# EAGLE design usb2ax_mini (EAGLE 5.11)
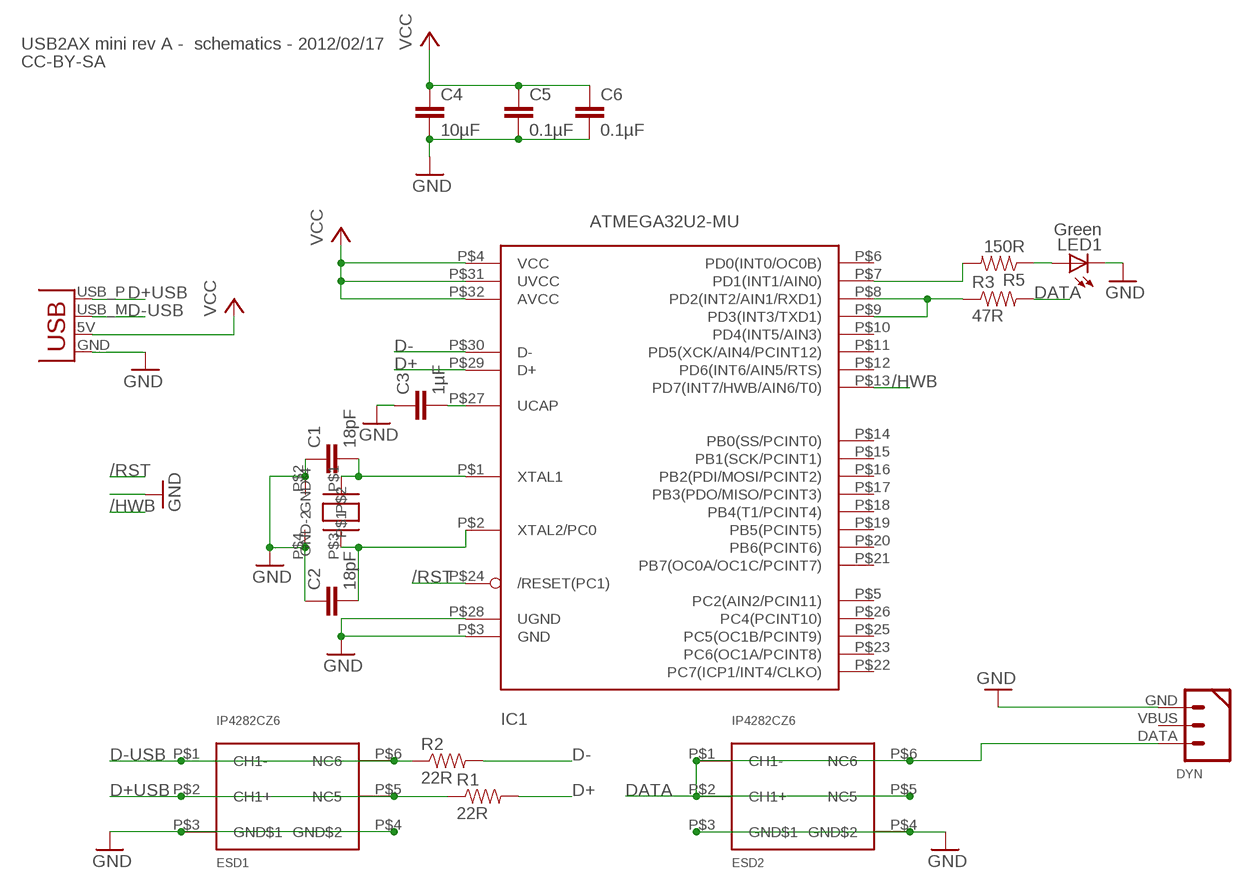
[diagram p0: schematic, sheet 1]

## Parts
C1  18pF  CAP0402-JLG  [0402-JLG]
C2  18pF  CAP0402-JLG  [0402-JLG]
C3  1µF  CAP0402-JLG  [0402-JLG]
C4  10µF  CAP0805  [0805]
C5  0.1µF  CAP0402-JLG  [0402-JLG]
C6  0.1µF  CAP0402-JLG  [0402-JLG]
DYN  DYNAMIXEL_3POS  [DYMANIXEL_3POS_RIGHT]
ESD1  IP4282CZ6  [SOT886]
ESD2  IP4282CZ6  [SOT886]
IC1  ATMEGA32U2-MU  ATMEGA32U2-AU  [QFN-32]
LED1  Green  LED-0603  [0603-LED]
Q  CRYSTAL  [MODEL-403]
R1  22R  RESISTOR0402-JLG  [0402-JLG]
R2  22R  RESISTOR0402-JLG  [0402-JLG]
R3  47R  RESISTOR0402-JLG  [0402-JLG]
R5  150R  RESISTOR0402-JLG  [0402-JLG]
X1  USBPCB  [USB-A-PCB]

## Nets
/HWB: IC1.P$13(PD7(INT7/HWB/AIN6/T0))
/RST: IC1.P$24(/RESET(PC1))
D+: IC1.P$29(D+) R1.P$2
D+USB: ESD1.P$2(CH1+) ESD1.P$5(NC5) R1.P$1 X1.USB_P(D+)
D-: IC1.P$30(D-) R2.P$2
D-USB: ESD1.P$1(CH1-) ESD1.P$6(NC6) R2.P$1 X1.USB_M(D-)
DATA: DYN.DATA ESD2.P$1(CH1-) ESD2.P$2(CH1+) ESD2.P$5(NC5) ESD2.P$6(NC6) R3.P$2
GND: C1.P$1 C2.P$1 C3.P$1 C4.2 C5.P$2 C6.P$2 DYN.GND ESD1.P$3(GND$1) ESD1.P$4(GND$2) ESD2.P$3(GND$1) ESD2.P$4(GND$2) IC1.P$3(GND) IC1.P$28(UGND) LED1.C Q.P$2(GND-2) Q.P$4(GND-4) X1.GND
N$1: IC1.P$7(PD1(INT1/AIN0)) R5.P$2
N$3: C1.P$2 IC1.P$1(XTAL1) Q.P$1
N$4: C2.P$2 IC1.P$2(XTAL2/PC0) Q.P$3
N$10: C3.P$2 IC1.P$27(UCAP)
N$13: IC1.P$8(PD2(INT2/AIN1/RXD1)) IC1.P$9(PD3(INT3/TXD1)) R3.P$1
N$14: LED1.A R5.P$1
VCC: C4.1 C5.P$1 C6.P$1 IC1.P$4(VCC) IC1.P$31(UVCC) IC1.P$32(AVCC) X1.5V(VBUS)
Unconnected: DYN.VBUS IC1.P$5(PC2(AIN2/PCIN11)) IC1.P$6(PD0(INT0/OC0B)) IC1.P$10(PD4(INT5/AIN3)) IC1.P$11(PD5(XCK/AIN4/PCINT12)) IC1.P$12(PD6(INT6/AIN5/RTS)) IC1.P$14(PB0(SS/PCINT0)) IC1.P$15(PB1(SCK/PCINT1)) IC1.P$16(PB2(PDI/MOSI/PCINT2)) IC1.P$17(PB3(PDO/MISO/PCINT3)) IC1.P$18(PB4(T1/PCINT4)) IC1.P$19(PB5(PCINT5)) IC1.P$20(PB6(PCINT6)) IC1.P$21(PB7(OC0A/OC1C/PCINT7)) IC1.P$22(PC7(ICP1/INT4/CLKO)) IC1.P$23(PC6(OC1A/PCINT8)) IC1.P$25(PC5(OC1B/PCINT9)) IC1.P$26(PC4(PCINT10))

## Notes on the sheet
- USB2AX mini rev A -  schematics - 2012/02/17
- CC-BY-SA

## Library data of the parts
C1-C6 = ParanoidStudio:CAP: Capacitor Standard 0603 ceramic capacitor, and 0.1" leaded capacitor.
DYN = ParanoidStudio:DYNAMIXEL_3POS
ESD1 ESD2 = ParanoidStudio:IP4282CZ6: Ultra-low capacitance ESD protection for high-speed interfaces
IC1 = ParanoidStudio:ATMEGA32U2: ATmega32u2 Pin compatible with the atmega8u2, atmega16u2 and atmega32u2 8, 16 or 32 K flash, 1K RAM, 512b EEPROM 8 bit and 16 bit timer (5 PWM total) UART, SPI (no I2C!) USB with 4 endpoints, LUFA compatible 22 I/O lines, analog comparator (no ADC!) Comes with DFU bootloader burned in!
LED1 = ParanoidStudio:LED
Q = ParanoidStudio:CRYSTAL
R1-R3 R5 = ParanoidStudio:RESISTOR: Resistor Basic schematic elements and footprints for 0603, 1206, and PTH 1/10th watt (small) resistors.
X1 = SparkFun-paranoidstudio:USB: USB Connectors USB-B-PTH is fully proven SKU : PRT-00139 USB-miniB is fully proven SKU : PRT-00587 USB-A-PCB is untested. USB-A-H is throughly reviewed, but untested. Spark Fun Electronics SKU : PRT-00437 USB-B-SMT is throughly reviewed, but untested. Needs silkscreen touching up. USB-A-S has not been used/tested USB-MB-H has not been used/tested

## Board
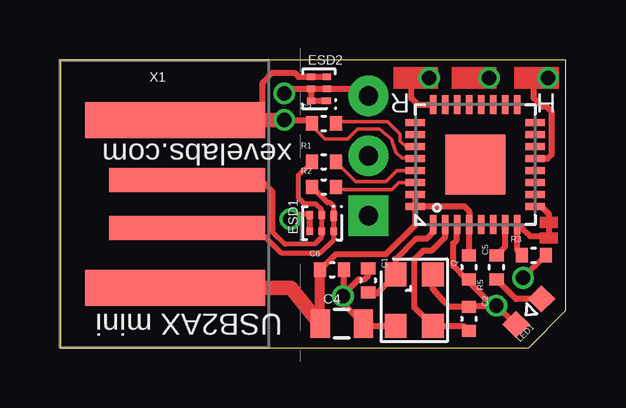
[diagram p1: board, top side]
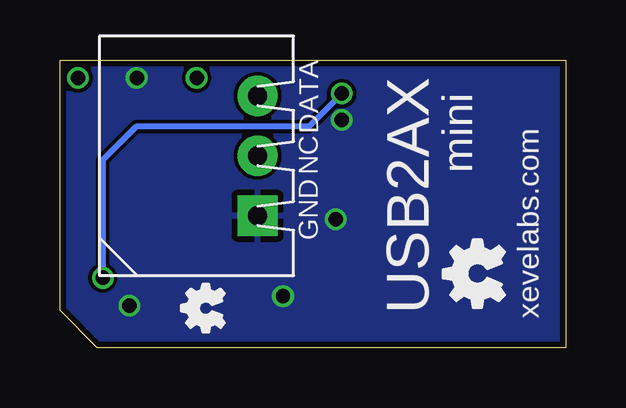
[diagram p2: board, bottom side, seen from below]

Size 21.1 x 12 mm. Coordinates in mm from the lower left corner, seen from the top.
Outline: 21.1,1.55 21.1,12 0,12 0,0 19.55,0 21.1,1.55
Copper layers (1*16): Top 0.035mm / dielectric 1.5mm / Bottom 0.035mm
Design rules "Fusion_eagle_rule_v1.1": minimum track width 6mil, minimum drill 12mil, track to track 6mil, track to pad 6mil, pad to pad 6mil, via to via 6mil, smd to smd 0mil, copper to edge 10mil, drill to drill 10mil, minimum pad ring 10mil, minimum via ring 6mil, stop-mask expansion 2mil, vias tented up to drill 100mil, thermal gap 10mil

### Footprints (pad centres in the part's own frame; a part is rotated, then mirrored left to right if it is on the bottom)
0402-JLG = smd 0.5 x 0.6: P$1 -0.5,0; P$2 0.5,0
0805 = smd 0.8 x 1.2: 1 -0.9,0; 2 0.9,0
DYMANIXEL_3POS_RIGHT = drill 0.8 pad 1.676 round: DATA 0,-5; VBUS 0,-2.5 | drill 0.8 pad 1.676 square: GND 0,0
SOT886 = smd 0.4 x 0.27: P$1 -0.3,0.5 | smd 0.325 x 0.27: P$2 -0.338,0; P$3 -0.338,-0.5; P$4 0.338,-0.5; P$5 0.338,0; P$6 0.338,0.5
QFN-32 = smd 0.285 x 0.8: P$1 -1.75,-2.5; P$2 -1.25,-2.5; P$3 -0.75,-2.5; P$4 -0.25,-2.5; P$5 0.25,-2.5; P$6 0.75,-2.5; P$7 1.25,-2.5; P$8 1.75,-2.5; P$17 1.75,2.5; P$18 1.25,2.5; P$19 0.75,2.5; P$20 0.25,2.5; P$21 -0.25,2.5; P$22 -0.75,2.5; P$23 -1.25,2.5; P$24 -1.75,2.5 | smd 0.8 x 0.285: P$9 2.5,-1.75; P$10 2.5,-1.25; P$11 2.5,-0.75; P$12 2.5,-0.25; P$13 2.5,0.25; P$14 2.5,0.75; P$15 2.5,1.25; P$16 2.5,1.75; P$25 -2.5,1.75; P$26 -2.5,1.25; P$27 -2.5,0.75; P$28 -2.5,0.25; P$29 -2.5,-0.25; P$30 -2.5,-0.75; P$31 -2.5,-1.25; P$32 -2.5,-1.75 | smd 2.5 x 2.5: P$33 0,0
0603-LED = smd 0.8 x 0.8: A -0.75,0; C 0.75,0
MODEL-403 = smd 1 x 0.9: P$1 -1.05,-0.75; P$2 1.1,-0.75; P$3 1.1,0.8; P$4 -1.05,0.8
USB-A-PCB = smd 7.5 x 1.5: 5V -0.2,-3.5; GND -0.2,3.5 | smd 6.5 x 1: USB_M 0.3,-1; USB_P 0.3,1

### Placement (x,y rotation side)
C1  12.85,2.8 270 top
C2  17.05,1.2 270 top
C3  11,9.35 0 top
C4  11.75,1 0 top
C5  17.05,3.35 270 top
C6  11.35,3.25 0 top
DYN  12.86,5.5 180 bottom
ESD1  10.92,5.19 270 top
ESD2  10.8,10.8 180 top
IC1  17.32,7.63 0 top
LED1  19.55,1.5 225 top
Q  14.75,2 270 top
R1  11,7.75 0 top
R2  11,6.7 0 top
R3  19.75,3.85 0 top
R5  18.2,3.35 90 top
U$1  [OSHW_FILLX70_NOTEXT]  14.25,0.65 90 bottom
U$2  [OSHW_FILLX100_NOTEXT]  2.57,1.67 90 bottom
X1  5,6 0 top

### Tracks (layer width: path | path; a pad name or v marks a point on that pad's centre or on a via)
/HWB  (via drill 0.6)
  Top 0.254: IC1.P$13 20.33,7.88 20.5,8.05 20.5,9.85 20.3,10.05 20.1,10.05 19.75,10.4 19.75,11.25 v20.35,11.25
/RST  (via drill 0.6)
  Top 0.254: IC1.P$24 14.92,10.13 14.65,10.4 14.65,11.1 14.8,11.25 v15.4,11.25
D+
  Top 0.152: R1.P$2 12.32,6.93 13.6,6.93 14.05,7.38 IC1.P$29
D+USB
  Top 0.203: R1.P$1 9.95,7.2 9.95,6.25 10.2,6 10.65,6 10.92,5.73 ESD1.P$2 ESD1.P$5 10.92,4.62 10.65,4.35 9.39,4.32 8.86,4.83 8.87,6.51 8.38,7 X1.USB_P
D-
  Top 0.152: IC1.P$30 14.13,6.88 13.85,6.6 11.7,6.6 11.6,6.7 R2.P$2
D-USB
  Top 0.203: R2.P$1 11.15,6.05 11.25,6.05 11.42,5.88 ESD1.P$1 ESD1.P$6 11.42,4.52 10.85,3.95 9.22,3.95 8.37,4.8 8.25,4.8 8.05,5 X1.USB_M
DATA  (via drill 0.6)
  Top 0.254: ESD2.P$5 ESD2.P$2 12.56,10.8 DYN.DATA | ESD2.P$1 ESD2.P$6 ESD2.P$5 | v19.31,2.91 R3.P$2 | ESD2.P$5 9.55,10.8 v9.35,10.6
  Bottom 0.254: v19.31,2.91 19.31,7.82 17.92,9.21 10.72,9.21 v9.35,10.6
GND  (via drill 0.6)
  Top 0.152: C3.P$1 10.5,9.25 11.05,8.7 11.98,8.7 12.4,9.12 13.33,9.12 13.83,8.69 14.02,8.14 14.26,7.9 14.79,7.9 IC1.P$28
  Top 0.203: ESD1.P$3 10.45,5.55 9.8,5.55 v9.6,5.35
  Top 0.254: ESD2.P$3 ESD2.P$4 9.94,11.3 9.78,11.46 8.85,11.46 8.45,11.06 8.45,9.52 8.43,9.5 | Q.P$4 15.55,2.45 15.95,2 16.25,1.7 C2.P$1 17.1,1.75 v18.2,1.75 | Q.P$2 12.7,0.9 C4.2 11.8,1.85 v11.8,2.15 | C1.P$1 12.8,3.3 12.75,3.25 12.85,3.25 12.85,3 12.7,2.85 12.45,2.85 11.8,2.2 v11.8,2.15 | IC1.P$3 16.55,5.12 16.55,4.5 16.4,4.35 16.4,3.4 16.95,2.85 | 16.95,2.85 C5.P$2 | v18.2,1.75 18.98,0.97 LED1.C | 16.95,2.85 18.05,1.75 v18.2,1.75 | v11.8,2.15 11.85,2.2 C6.P$2 | ESD1.P$4 ESD1.P$3 | v9.35,9.5 10.35,9.5 C3.P$1
  Top 0.61: X1.GND 8.43,9.5 v9.35,9.5
  other vias: 17.9,11.25
  pour Bottom: -2.05,13.53 22.4,13.93 22.95,-2.5 -2.3,-2.35
N$1
  Top 0.254: R5.P$2 18.57,4.21 IC1.P$7
N$3
  Top 0.254: C1.P$2 13.2,2.25 Q.P$1 14,3.7 14.85,4.55 15.3,4.55 15.56,4.82 IC1.P$1
N$4
  Top 0.254: IC1.P$2 16.07,4.62 15.5,4.05 15.15,4.05 14.78,3.68 14.78,1.67 Q.P$3 16.85,0.9 C2.P$2
N$10
  Top 0.152: IC1.P$27 14.42,8.38 14.18,8.62 14.18,8.9 13.65,9.43 11.58,9.43 C3.P$2
N$13
  Top 0.254: R3.P$1 19.07,4.07 IC1.P$8 19.59,4.65 20.4,4.65 20.4,5.55 20.07,5.88 IC1.P$9
N$14
  Top 0.254: R5.P$1 19.02,2.03 LED1.A
VCC
  Top 0.254: IC1.P$32 IC1.P$31 | C5.P$1 17.05,5.12 IC1.P$4 17.07,5.68 16.85,5.9 14.84,5.9 IC1.P$32 | C6.P$1 11.5,3.9 13.6,3.9 14.81,5.12 IC1.P$32
  Top 0.406: C4.1 C6.P$1
  Top 0.61: X1.5V 9.63,2.5 C4.1
(copper drawn outside any net)
  shapes: Top area x5

### Text on the board
tPlace: R | H | xevelabs.com | USB2AX mini
bPlace: DATA | mini | NC | GND | xevelabs.com | USB2AX